# Altium schematic sheet RC reciever.SchDoc
size A
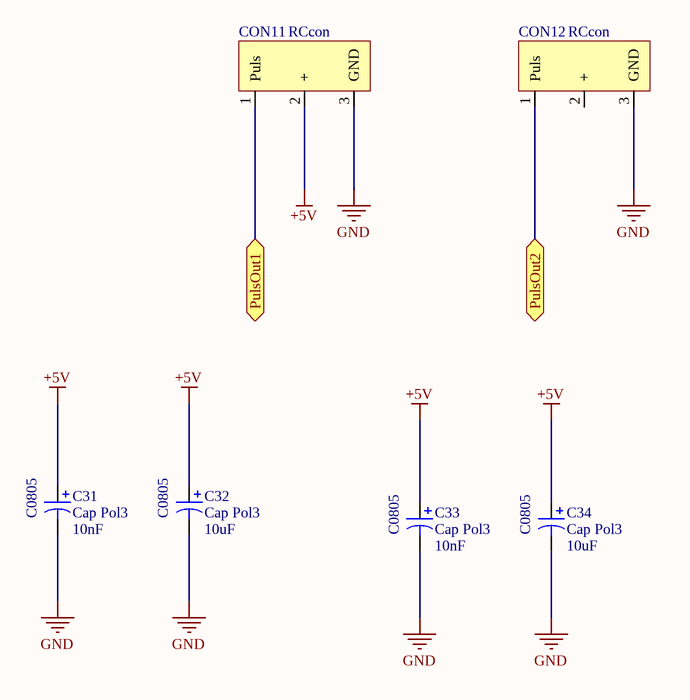
[diagram p0: RC reciever.SchDoc]

## Parts
C31  Cap Pol3  value 10nF  [C0805]
C32  Cap Pol3  value 10uF  [C0805]
C33  Cap Pol3  value 10nF  [C0805]
C34  Cap Pol3  value 10uF  [C0805]
CON11  RCcon  [RcCon]
CON12  RCcon  [RcCon]

## Ports
PulsOut1, PulsOut2

## Nets
+5V: C31.1 C32.1 C33.1 C34.1 CON11.2(+)
GND: C31.2 C32.2 C33.2 C34.2 CON11.3(GND) CON12.3(GND)
PulsOut1: CON11.1(Puls) ; port PulsOut1
PulsOut2: CON12.1(Puls) ; port PulsOut2

Not connected (* = marked no-connect by the designer): CON12 2(+)

## Library data of the parts
C31-C34 = Cap Pol3: Polarized Capacitor (Surface Mount); Published: 8-Jun-2000; LatestRevisionDate: 29-May-2009; LatestRevisionNote: IPC-7351 Footprint Added.; PackageReference: C0805; Publisher: Altium Limited; PackageDescription: Chip Capacitor
CON11 CON12 = Rc con